# Altium schematic sheet MB1166.SchDoc: 4 inch DSI LCD board
size A4; DocumentNumber: MB1166; Revision: A.1; SheetNumber: 2; SheetTotal: 2; Project: LCD daugterboard
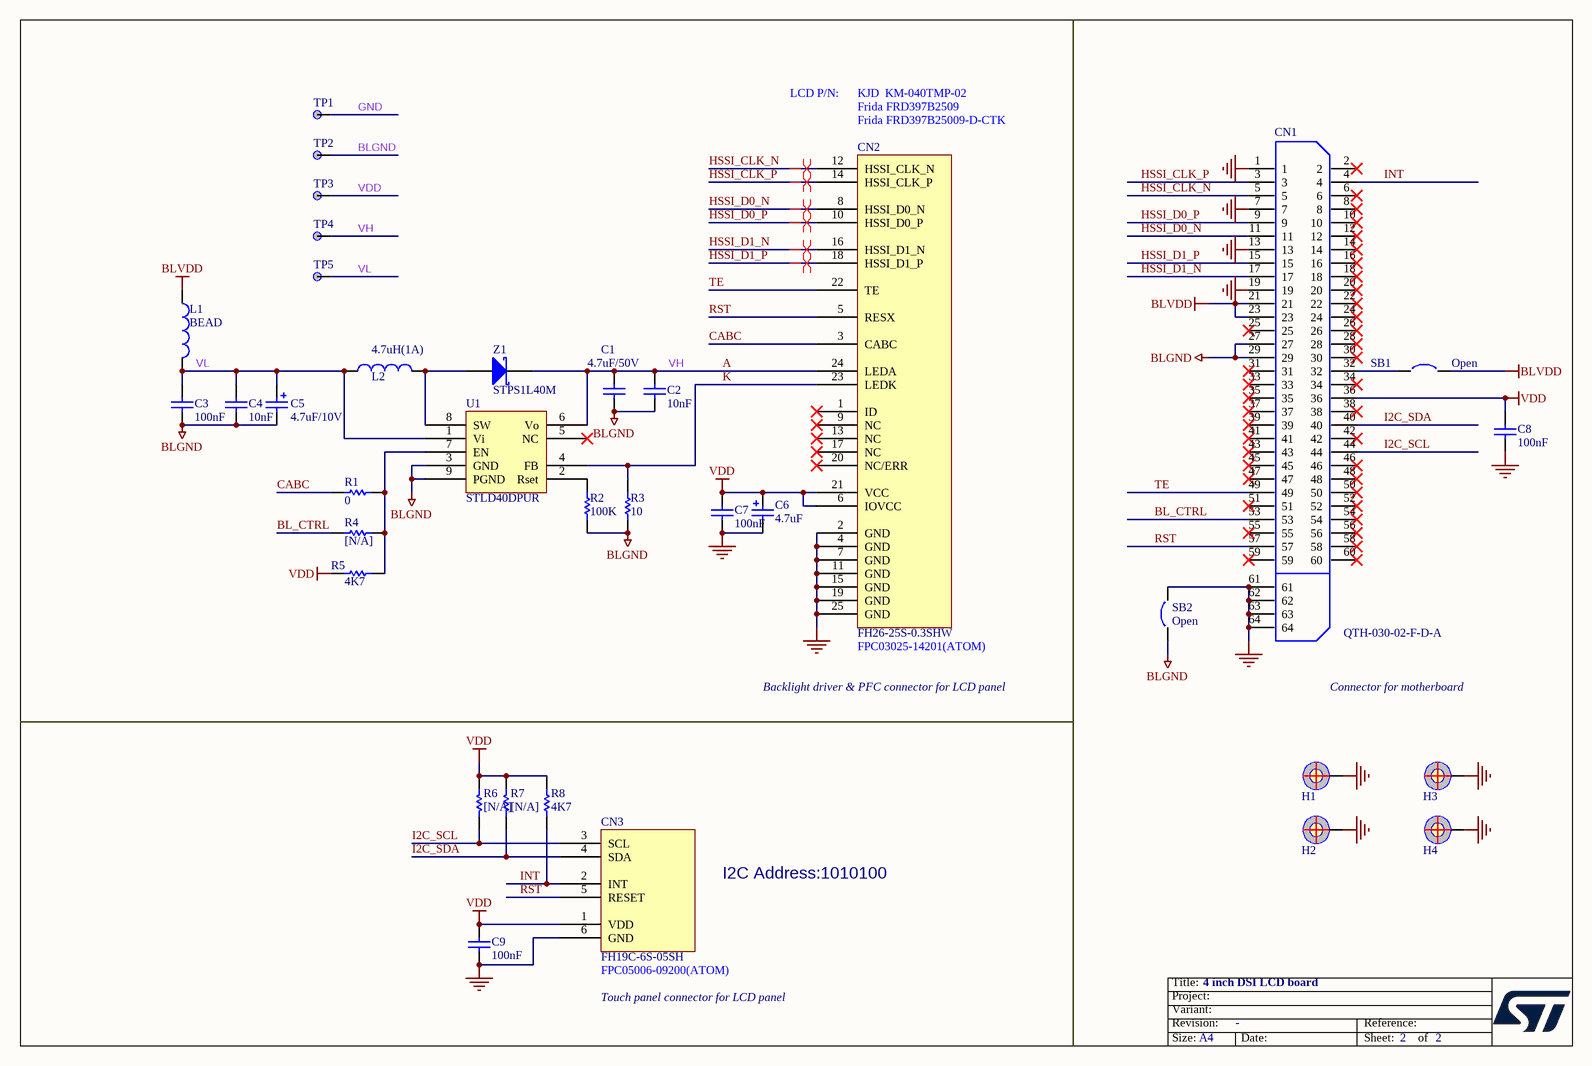
[diagram p0: MB1166.SchDoc]

## Parts
C1  4.7uF/50V  [1206C]
C2  10nF  [0603C]
C3  100nF  [0603C]
C4  10nF  [0603C]
C5  4.7uF/10V  [1206C]
C6  4.7uF  [TAN-A]
C7  100nF  [0603C]
C8  100nF  [0603C]
C9  100nF  [0603C]
CN1  QTH-030-02-F-D-A  [QTH-030-02-F-D-A]
CN2  FH26-25S-0.3SHW  [FPC25_FPC03025-1420]
CN3  FH19C-6S-05SH  [FH19C-6S-0R5Sh_FPC_CPT]
H1  POSITION HOLE  [HOLE_C9D4R5]  (value not drawn)
H2  POSITION HOLE  [HOLE_C9D4R5]  (value not drawn)
H3  POSITION HOLE  [HOLE_C9D4R5]  (value not drawn)
H4  POSITION HOLE  [HOLE_C9D4R5]  (value not drawn)
L1  BEAD  [0603L]
L2  4.7uH(1A)  [1210L]
R1  0  [0603R]
R2  100K  [0603R]
R3  10  [0603R]
R4  [N/A]  [0603R]
R5  4K7  [0603R]
R6  [N/A]  [0603R]
R7  [N/A]  [0603R]
R8  4K7  [0603R]
SB1  Open  [SB_0603]
SB2  Open  [SB_0603]
TP1  (no value)  [TP]
TP2  (no value)  [TP]
TP3  (no value)  [TP]
TP4  (no value)  [TP]
TP5  (no value)  [TP]
U1  STLD40DPUR  [SON8_0R65_3X3]
Z1  STPS1L40M  [DO-216AA]

## Nets
BLGND: C1.2 C2.1 C3.1 C4.1 C5.2 CN1.27 CN1.29 R2.2 R3.1 SB2.1 TP2.1 U1.3(GND) U1.9(PGND)
BLVDD: CN1.21 CN1.23 L1.1 SB1.2
GND: C6.2 C7.1 C8.1 C9.1 CN1.1 CN1.7 CN1.13 CN1.19 CN1.61 CN1.62 CN1.63 CN1.64 CN2.2(GND) CN2.4(GND) CN2.7(GND) CN2.11(GND) CN2.15(GND) CN2.19(GND) CN2.25(GND) CN3.6(GND) H1.1 H2.1 H3.1 H4.1 SB2.2 TP1.1
VDD: C6.1 C7.2 C8.2 C9.2 CN1.36 CN2.6(IOVCC) CN2.21(VCC) CN3.1(VDD) R5.2 R6.2 R7.2 R8.1 TP3.1
A: C1.1 C2.2 CN2.24(LEDA) TP4.1 U1.6(Vo) Z1.2(K)  [also labelled VH]
BL_CTRL: CN1.53 R4.2
CABC: CN2.3(CABC) R1.2
HSSI_CLK_N: CN1.5 CN2.12(HSSI_CLK_N)
HSSI_CLK_P: CN1.3 CN2.14(HSSI_CLK_P)
HSSI_D0_N: CN1.11 CN2.8(HSSI_D0_N)
HSSI_D0_P: CN1.9 CN2.10(HSSI_D0_P)
HSSI_D1_N: CN1.17 CN2.16(HSSI_D1_N)
HSSI_D1_P: CN1.15 CN2.18(HSSI_D1_P)
I2C_SCL: CN1.44 CN3.3(SCL) R6.1
I2C_SDA: CN1.40 CN3.4(SDA) R7.1
INT: CN1.4 CN3.2(INT) R8.2
K: CN2.23(LEDK) R3.2 U1.4(FB)
RST: CN1.57 CN2.5(RESX) CN3.5(RESET)
TE: CN1.49 CN2.22(TE)
VL: C3.2 C4.2 C5.1 L1.2 L2.1 TP5.1 U1.1(Vi)
NetCN1_32: CN1.32 SB1.1
NetL2_2: L2.2 U1.8(SW) Z1.1(A)
NetR1_1: R1.1 R4.1 R5.1 U1.7(EN)
NetR2_1: R2.1 U1.2(Rset)

Not connected (* = marked no-connect by the designer): CN1 2* 6* 8* 10* 12* 14* 16* 18* 20* 22* 24* 25* 26* 28* 30* 31* 33* 34* 35* 37* 38* 39* 41* 42* 43* 45* 46* 47* 48* 50* 51* 52* 54* 55* 56* 58* 59* 60*; CN2 1(ID)* 9(NC)* 13(NC)* 17(NC)* 20(NC/ERR)*; U1 5(NC)*

## Layout directives
differential pair: HSSI_CLK_N, HSSI_CLK_P, HSSI_D0_N, HSSI_D0_P, HSSI_D1_N, HSSI_D1_P

## Notes on the sheet
- LCD P/N:
- KJD  KM-040TMP-02
- Frida FRD397B2509
- (near CN2) Frida FRD397B25009-D-CTK
- (near CN2) FPC03025-14201(ATOM)
- Backlight driver & PFC connector for LCD panel
- Connector for motherboard
- I2C Address:1010100
- Touch panel connector for LCD panel
- (near CN3) FPC05006-09200(ATOM)
- Title:
- Project:
- Size:
- Revision:
- Variant:
- A4
- -
- Date:
- Reference:
- Sheet:
- of

## Library data of the parts
C1-C4 C7-C9 = CAP: Capacitor; Value: 100pF; Published: 8-Jun-2000; Revision: July-2002: Re-released for DXP Platform.; Publisher: Altium Limited
C5 C6 = Cap Pol1: Polarized Capacitor (Radial); Value: 100pF; Published: 8-Jun-2000; Revision: July-2002: Re-released for DXP Platform.; Publisher: Altium Limited
CN1 = QTH-030-02-F-D-A: HIGH SPEED TERMINAL STRIP, .5mm PITCH, 60 PINS.; MANUFACTURER: SAMTEC; PCB DECAL: QTH-030-02-X-D-A; CREATED: 16 FEB 2013 - WENDY XIN
L1 L2 = Inductor: Value: 100uH; Published: 8-Jun-2000; Revision: July-2002: Re-released for DXP Platform.; Publisher: Altium Limited
R1-R8 = Res1: Resistor; Value: 1K; Published: 8-Jun-2000; Revision: July-2002: Re-released for DXP Platform.; Publisher: Altium Limited
SB1 SB2 = Circuit Breaker: Published: 24-Mar-1999; Revision: July-2002: Re-released for DXP Platform.; Publisher: Altium Limited
TP1-TP5 = TP
U1 = STLD40DPMR
Z1 = D Schottky: Schottky Diode; Code - JEDEC: DO-214-AA; Published: 8-Jun-2000; Revision: July-2002: Re-released for DXP Platform.; Publisher: Altium Limited